# EAGLE design Mosfetboard (EAGLE 9.2.2)
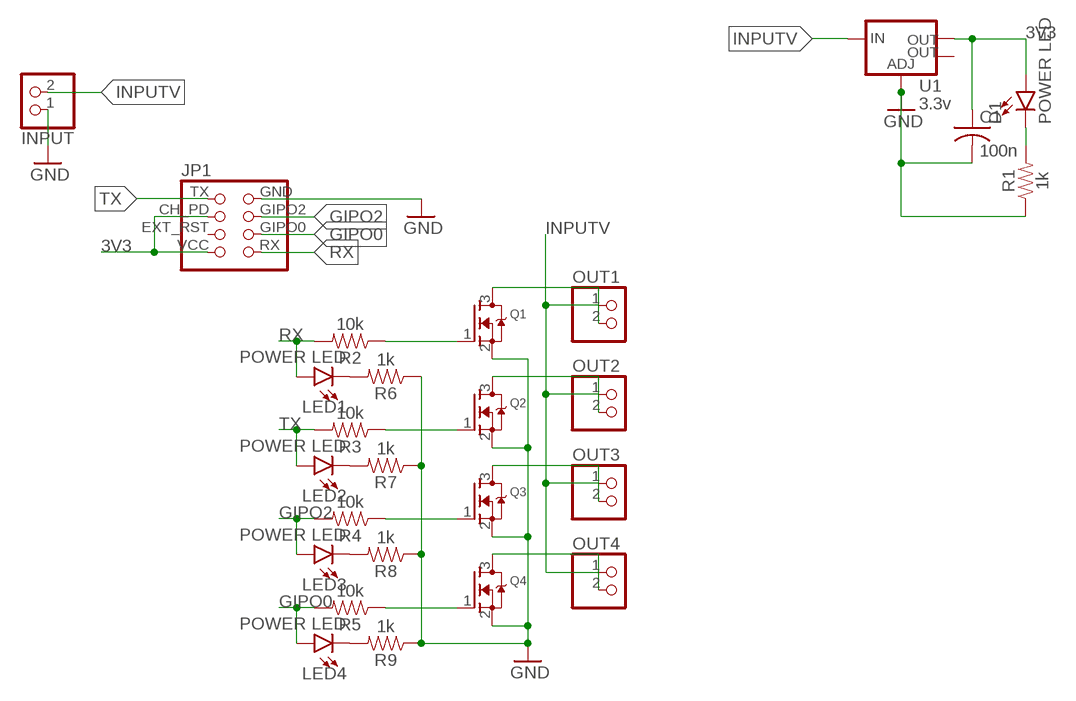
[diagram p0: schematic, sheet 1]

## Parts
C1  100n  C-USC1206K  [C1206K]
D1  POWER LED  LED-BLUE0805  [LED-0805]
INPUT  PINHD-1X2  [1X02]
JP1  ESP-01-FEMALE  [ESP-01-FEMALE]
LED1  POWER LED  LED-BLUE0805  [LED-0805]
LED2  POWER LED  LED-BLUE0805  [LED-0805]
LED3  POWER LED  LED-BLUE0805  [LED-0805]
LED4  POWER LED  LED-BLUE0805  [LED-0805]
OUT1  PINHD-1X2  [1X02]
OUT2  PINHD-1X2  [1X02]
OUT3  PINHD-1X2  [1X02]
OUT4  PINHD-1X2  [1X02]
Q1  MOSFET-NREFLOW  [SOT23]
Q2  MOSFET-NREFLOW  [SOT23]
Q3  MOSFET-NREFLOW  [SOT23]
Q4  MOSFET-NREFLOW  [SOT23]
R1  1k  RESISTOR0805  [0805]
R2  10k  RESISTOR0805  [0805]
R3  10k  RESISTOR0805  [0805]
R4  10k  RESISTOR0805  [0805]
R5  10k  RESISTOR0805  [0805]
R6  1k  RESISTOR0805  [0805]
R7  1k  RESISTOR0805  [0805]
R8  1k  RESISTOR0805  [0805]
R9  1k  RESISTOR0805  [0805]
U1  3.3v  V_REG_LM1117SOT223  [SOT223]

## Nets
3V3: C1.1 D1.+(A) JP1.CH_PD(CHIP_EN) JP1.VCC U1.2(OUT)
GIPO0: JP1.GIPO0 LED4.+(A) R5.2
GIPO2: JP1.GIPO2 LED3.+(A) R4.2
GND: C1.2 INPUT.1 JP1.GND Q1.2(S) Q2.2(S) Q3.2(S) Q4.2(S) R1.1 R6.1 R7.1 R8.1 R9.1 U1.1(ADJ)
INPUTV: INPUT.2 OUT1.1 OUT2.1 OUT3.1 OUT4.1 U1.3(IN)
N$1: OUT1.2 Q1.3(D)
N$2: OUT2.2 Q2.3(D)
N$3: OUT3.2 Q3.3(D)
N$4: OUT4.2 Q4.3(D)
N$5: D1.-(C) R1.2
N$6: Q1.1(G) R2.1
N$7: Q2.1(G) R3.1
N$8: Q3.1(G) R4.1
N$9: Q4.1(G) R5.1
N$10: LED1.-(C) R6.2
N$11: LED2.-(C) R7.2
N$12: LED3.-(C) R8.2
N$13: LED4.-(C) R9.2
RX: JP1.RX LED1.+(A) R2.2
TX: JP1.TX LED2.+(A) R3.2
Unconnected: JP1.EXT_RST U1.4(OUT)

## Library data of the parts
C1 = simple-shiled:C-US: CAPACITOR, American symbol
D1 LED1-LED4 = simple-shiled:LED-BLUE: Blue SMD LED Used in manufacturing of various products at SparkFun Packages: 0603 - SMD 0603 package [Product Link] <http://www.digikey.com/product-detail/en/SMLE12BC7TT86/511-1589-2-ND/1641808> 1206 - SMD1206 package [Product Link] <http://www.digikey.com/product-detail/en/lite-on-inc/LTST-C150TBKT/160-1643-1-ND/573584> SparkFun Products: ESP8266 Thing-Dev Board <https://www.sparkfun.com/products/13711> RedBoard <https://www.sparkfun.com/products/12757>
INPUT OUT1-OUT4 = simple-shiled:PINHD-1X2: PIN HEADER
JP1 = simple-shiled:ESP-01-FEMALE: PIN HEADER
Q1-Q4 = simple-shiled:MOSFET-N: N-Channel Mosfet 2N7002E - 60V 260mA SOT23 [Digikey: 2N7002ET1GOSTR-ND] - REEL BSH103 - 30V 850mA SOT23 [Digikey: 568-5013-1-ND]
R1-R9 = simple-shiled:RESISTOR: Generic Resistor Package
U1 = simple-shiled:V_REG_LM1117: Voltage Regulator LM1117 Standard adjustable voltage regulator but in SMD form. Spark Fun Electronics SKU : COM-00595; PROD_ID: VREG-08170

## Board
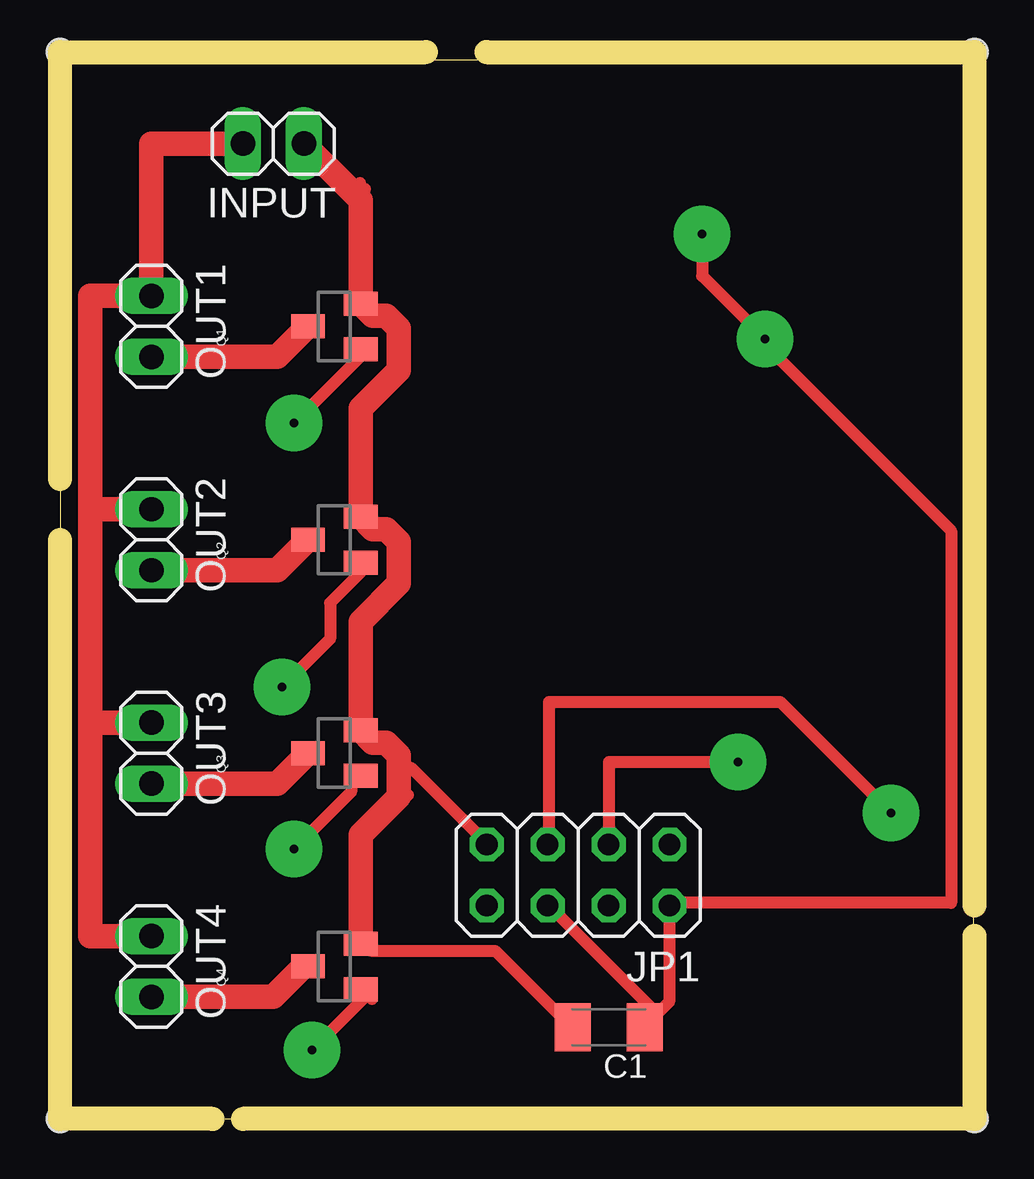
[diagram p1: board, top side]
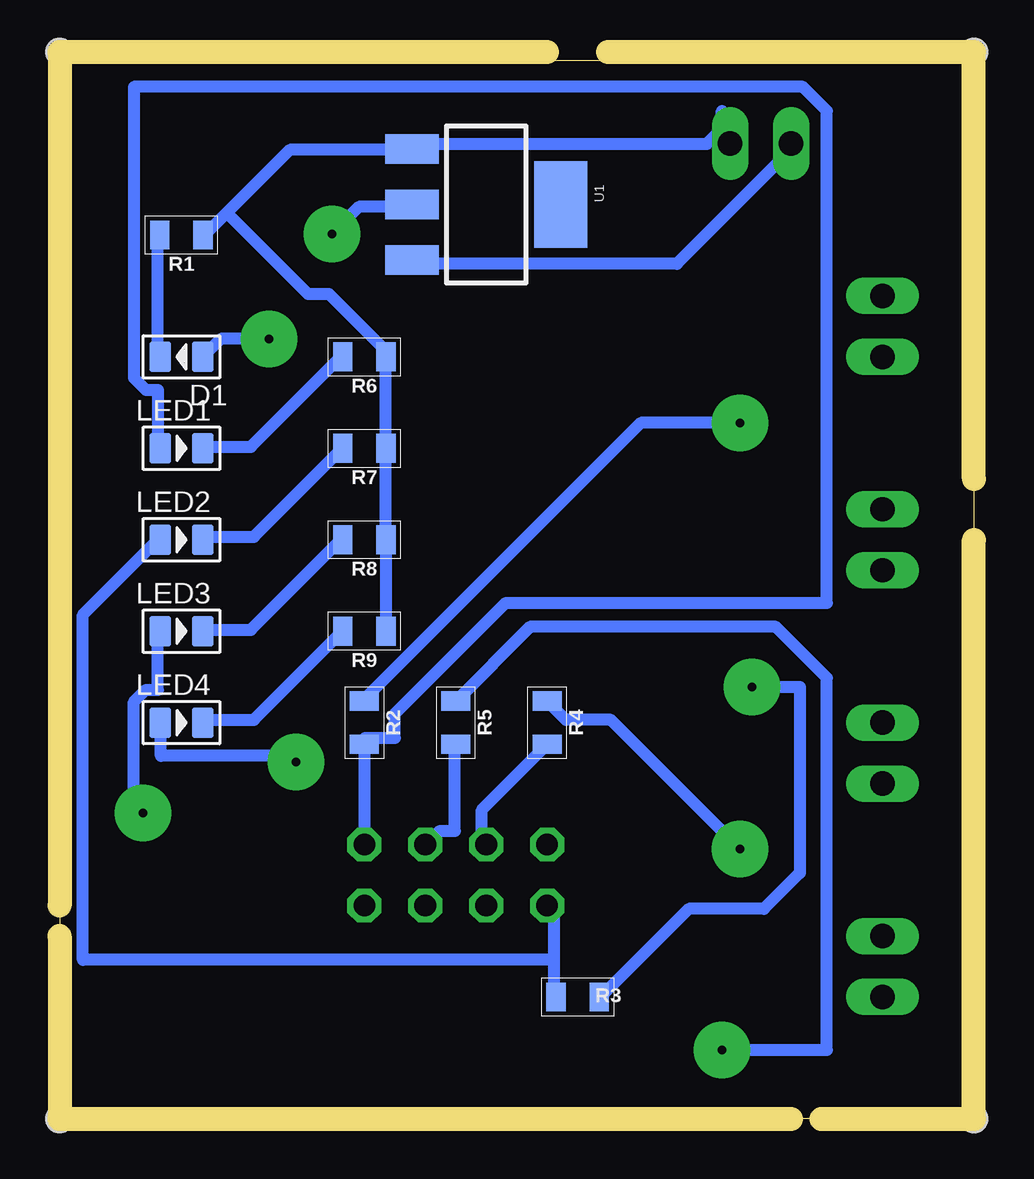
[diagram p2: board, bottom side, seen from below]

Size 38.08 x 44.12 mm. Coordinates in mm from the lower left corner, seen from the top.
Outline: 0,0 38.08,0 38.08,44.12 0,44.12 0,0
Copper layers (1*16): Top 0.035mm / dielectric 1.5mm / Bottom 0.035mm
Design rules "prototype": minimum track width 20mil, minimum drill 0.35mm, track to track 18mil, track to pad 15mil, pad to pad 20mil, via to via 40mil, smd to smd 6mil, copper to edge 20mil, drill to drill 20mil, minimum pad ring 10mil, minimum via ring 1mm, stop-mask expansion 4mil, vias tented up to drill 0mil, thermal gap 10mil
Holes 1.1 mm at 0,44.45 38.1,44.45 38.1,0 0,0
Milling: 8 lines

### Footprints (pad centres in the part's own frame; a part is rotated, then mirrored left to right if it is on the bottom)
C1206K = smd 1.5 x 2: 1 -1.5,0; 2 1.5,0
LED-0805 = smd 0.889 x 1.27: + -0.889,0; - 0.889,0
1X02 = drill 1.016 long: 1 -1.27,0; 2 1.27,0
ESP-01-FEMALE = drill 0.9 octagon: CH_PD 1.27,1.27; EXT_RST -1.27,1.27; GIPO0 -1.27,-1.27; GIPO2 1.27,-1.27; GND 3.81,-1.27; RX -3.81,-1.27; TX 3.81,1.27; VCC -3.81,1.27
SOT23 = smd 1 x 1.4: 1 -0.95,-1.1; 2 0.95,-1.1; 3 0,1.1
0805 = smd 0.8 x 1.2: 1 -0.9,0; 2 0.9,0
SOT223 = smd 1.219 x 2.235: 1 -2.311,-3.099; 2 0,-3.099; 3 2.311,-3.099 | smd 3.6 x 2.2: 4 0,3.099

### Placement (x,y rotation side)
C1  22.86,3.81 180 top
D1  33.02,31.75 180 bottom
INPUT  8.89,40.64 180 top
JP1  21.59,10.16 180 top
LED1  33.02,27.94 0 bottom
LED2  33.02,24.13 0 bottom
LED3  33.02,20.32 0 bottom
LED4  33.02,16.51 0 bottom
OUT1  3.81,33.02 270 top
OUT2  3.81,24.13 270 top
OUT3  3.81,15.24 270 top
OUT4  3.81,6.35 270 top
Q1  11.43,33.02 90 top
Q2  11.43,24.13 90 top
Q3  11.43,15.24 90 top
Q4  11.43,6.35 90 top
R1  33.02,36.83 180 bottom
R2  25.4,16.51 270 bottom
R3  16.51,5.08 180 bottom
R4  17.78,16.51 270 bottom
R5  21.59,16.51 270 bottom
R6  25.4,31.75 180 bottom
R7  25.4,27.94 180 bottom
R8  25.4,24.13 180 bottom
R9  25.4,20.32 180 bottom
U1  20.32,38.1 270 bottom

### Tracks (layer width: path | path; a pad name or v marks a point on that pad's centre or on a via)
3V3  (via drill 0.35)
  Top 0.508: JP1.CH_PD 20.38,8.88 24.75,4.5 C1.1 24.38,3.88 25.38,4.88 25.38,8.88 JP1.VCC 25.62,9 37.12,9 37.12,24.5 29.38,32.25 v29.38,32.5 26.75,35.12 v26.75,36.88
  Bottom 0.508: v29.38,32.5 31.38,32.5 D1.+ | v26.75,36.88 25.62,38 23.5,38 U1.2
GIPO0  (via drill 0.35)
  Top 0.508: v28.25,14.88 22.88,14.88 22.88,11.5 JP1.GIPO0
  Bottom 0.508: R5.2 21.62,15.5 21.62,12 22.25,12 22.75,11.5 JP1.GIPO0 | v28.25,14.88 28.5,15.12 33.88,15.12 33.88,16.5 LED4.+
GIPO2  (via drill 0.35)
  Top 0.508: v34.62,12.75 30,17.38 20.38,17.38 20.38,11.5 JP1.GIPO2
  Bottom 0.508: R4.2 17.88,15.5 20.5,12.88 20.5,11.5 20.38,11.5 JP1.GIPO2 | v34.62,12.75 35,12.75 35,17.38 34.5,17.88 34,17.88 34,20.25 LED3.+
GND
  Top 0.508: 12.7,38.73 12.53,38.27 | 12.5,39 12.15,38.65 | Q4.2 13,7 18.12,7 21.25,3.88 C1.2 | 14.5,13.5 14.12,13.42 | JP1.GND 17.75,11.5 14.62,14.62 14.12,14.62
  Top 1.016: INPUT.1 12.15,38.65 12.53,38.27 Q1.2 13.04,33.46 13.6,33.46 14.12,32.94 14.12,31.2 12.53,29.61 Q2.2 13.04,24.57 13.6,24.57 14.12,24.05 14.12,22.31 12.53,20.72 Q3.2 13.04,15.68 13.6,15.68 14.12,15.16 14.12,14.62 14.12,13.42 12.53,11.83 Q4.2
  Bottom 0.508: 10.5,42 10.5,41 INPUT.1 10.75,41 11.12,40.62 23.38,40.62 U1.1 23.5,40.38 28.5,40.38 31.12,37.75 | R9.1 R8.1 R7.1 R6.1 24.5,32 26.88,34.38 27.75,34.38 31.12,37.75 | 31.12,37.75 32,36.88 R1.1
INPUTV
  Top 1.016: INPUT.2 3.81,40.64 OUT1.1 1.27,34.29 1.27,25.4 | 1.27,25.4 OUT2.1 | 1.27,25.4 1.27,16.51 | 1.27,16.51 OUT3.1 | 1.27,16.51 1.27,7.62 OUT4.1
  Bottom 0.508: U1.3 23.38,35.75 23.25,35.62 12.38,35.62 7.62,40.38 7.62,40.62 INPUT.2
N$1
  Top 1.016: OUT1.2 9.06,31.75 Q1.3
N$2
  Top 1.016: OUT2.2 9.06,22.86 Q2.3
N$3
  Top 1.016: OUT3.2 9.06,13.97 Q3.3
N$4
  Top 1.016: OUT4.2 8.89,5.08 10.16,6.35 Q4.3
N$5
  Bottom 0.508: R1.2 34,36.75 34,31.75 D1.-
N$6  (via drill 0.35)
  Top 0.508: 12.5,32 Q1.1 12.5,31.75 v9.75,29
  Bottom 0.508: v9.75,29 13.88,29 25.38,17.5 R2.1
N$7  (via drill 0.35)
  Top 0.508: 12.5,23 Q2.1 12.5,22.75 11.25,21.5 11.25,20 v9.25,18
  Bottom 0.508: v9.25,18 7.25,18 7.25,10.25 8.75,8.75 11.88,8.75 15.5,5.12 R3.1
N$8  (via drill 0.35)
  Top 0.508: 12.29,14.29 Q3.1 12.12,14.12 12.12,13.62 v9.75,11.25
  Bottom 0.508: v9.75,11.25 15.12,16.62 17,16.62 17.75,17.38 R4.1
N$9  (via drill 0.35)
  Top 0.508: 13,5 Q4.1 12.62,5 v10.5,2.88
  Bottom 0.508: R5.1 18.5,20.5 8.25,20.5 6.12,18.38 6.12,2.88 v10.5,2.88
N$10
  Bottom 0.508: R6.2 26.38,31.75 30.12,28 32.12,28 LED1.-
N$11
  Bottom 0.508: R7.2 26.38,27.88 30,24.25 32.12,24.25 LED2.-
N$12
  Bottom 0.508: R8.2 26.38,24.12 30.12,20.38 32.12,20.38 LED3.-
N$13
  Bottom 0.508: R9.2 26.38,20.25 30,16.62 32.12,16.62 LED4.-
RX
  Bottom 0.508: JP1.RX 25.38,11.5 25.38,15.5 R2.2 25.38,15.88 24.12,15.88 24.12,16.88 19.5,21.5 6.12,21.5 6.12,42 7.12,43 35,43 35,30.88 34.5,30.38 34,30.38 34,28 LED1.+
TX
  Bottom 0.508: 17.5,6.62 17.5,8.88 17.75,8.88 JP1.TX | 17.5,6.62 17.5,5.12 R3.2 | 17.5,6.62 37.12,6.62 37.12,21 34,24.12 LED2.+